# Altium schematic sheet Connectors.SchDoc
size A4; Organization: Deutsches Zentrum für Luft-; Address1: und Raumfahrt e.V. (DLR); Address2: Institut für Materialphysik; Address3: im Weltraum; Address4: Linder Höhe - 51147 Köln; DocumentNumber: 2; SheetNumber: 2; SheetTotal: 4
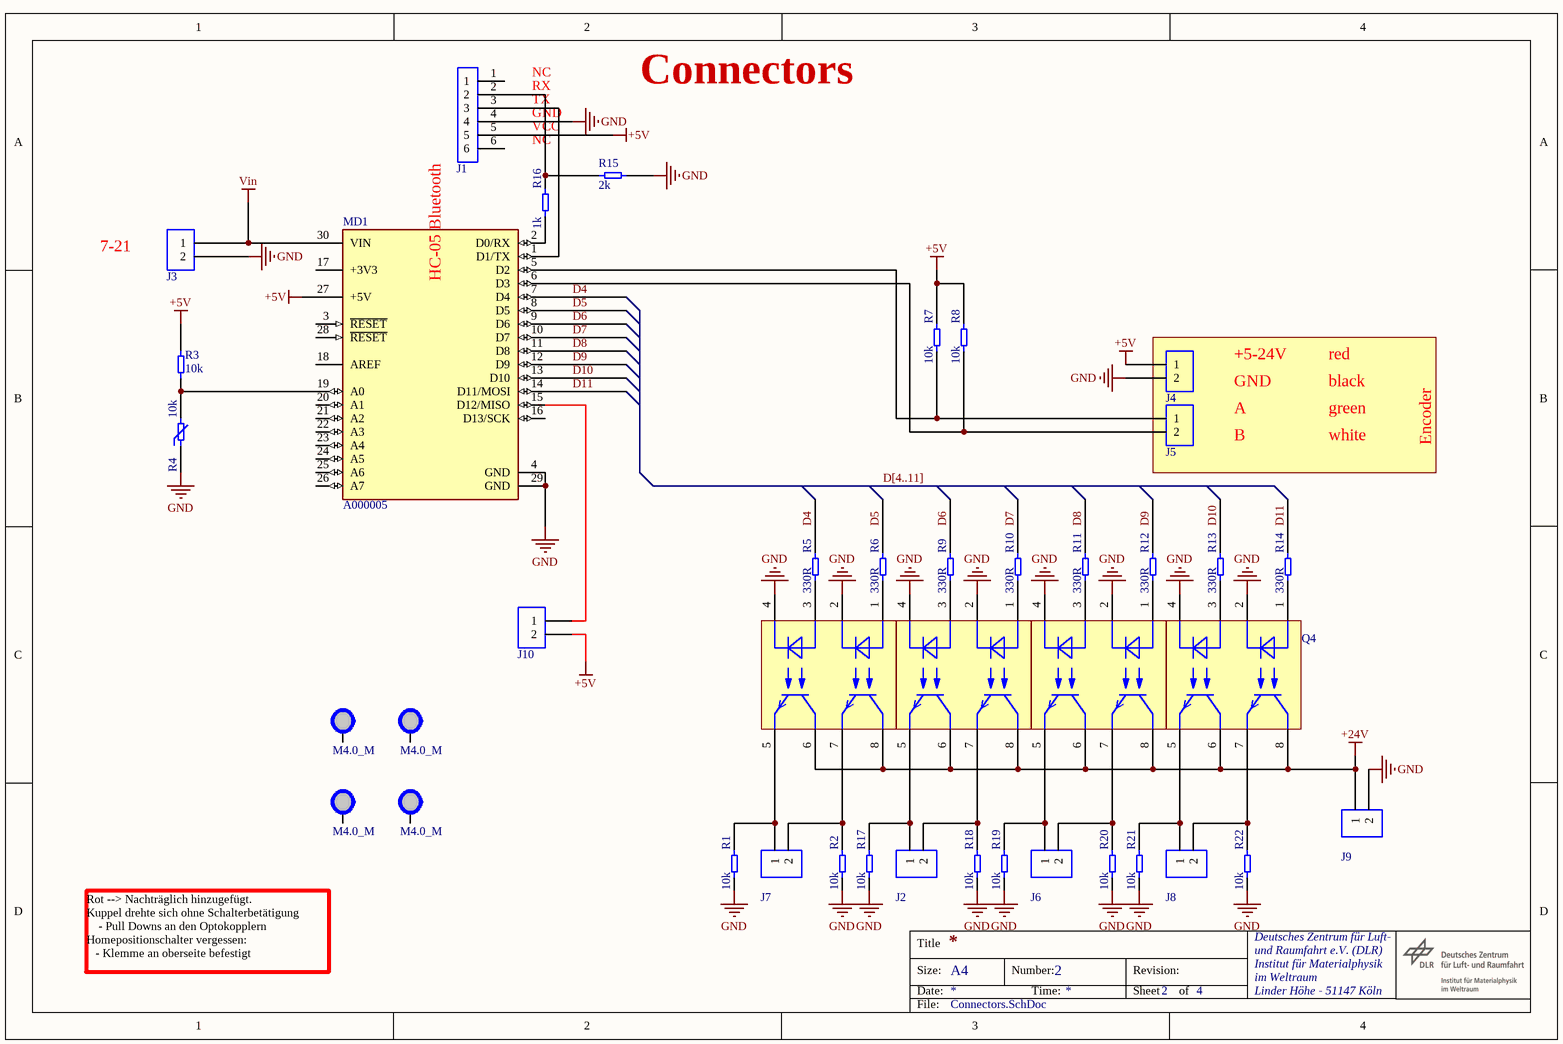
[diagram p0: Connectors.SchDoc]

## Parts
Drill1  M4.0_M  [M4.0_M]  (no BOM)
Drill2  M4.0_M  [M4.0_M]  (no BOM)
Drill3  M4.0_M  [M4.0_M]  (no BOM)
Drill4  M4.0_M  [M4.0_M]  (no BOM)
J1  61300611121  [6P Stiftleiste 2,54]  (value not drawn)
J2  PM_5.08_3_90_3.5_SW_-176052000  [MKDSN 5,08/2 2,5]  (value not drawn)
J3  PM_5.08_3_90_3.5_SW_-176052000  [MKDSN 5,08/2 2,5]  (value not drawn)
J4  PM_5.08_3_90_3.5_SW_-176052000  [MKDSN 5,08/2 2,5]  (value not drawn)
J5  PM_5.08_3_90_3.5_SW_-176052000  [MKDSN 5,08/2 2,5]  (value not drawn)
J6  PM_5.08_3_90_3.5_SW_-176052000  [MKDSN 5,08/2 2,5]  (value not drawn)
J7  PM_5.08_3_90_3.5_SW_-176052000  [MKDSN 5,08/2 2,5]  (value not drawn)
J8  PM_5.08_3_90_3.5_SW_-176052000  [MKDSN 5,08/2 2,5]  (value not drawn)
J9  PM_5.08_3_90_3.5_SW_-176052000  [MKDSN 5,08/2 2,5]  (value not drawn)
J10  PM_5.08_3_90_3.5_SW_-176052000  [MKDSN 5,08/2 2,5]  (value not drawn)
MD1  A000005  [FP-A000005-MFG]
Q1  140827180010  [WL-OCPT_DIP8_Standard]  (value not drawn)
Q2  140827180010  [WL-OCPT_DIP8_Standard]  (value not drawn)
Q3  140827180010  [WL-OCPT_DIP8_Standard]  (value not drawn)
Q4  140827180010  [WL-OCPT_DIP8_Standard]  (value not drawn)
R1  10k  [laser AXIAL-0.5]
R2  10k  [laser AXIAL-0.5]
R3  10k  [laser AXIAL-0.5]
R4  10k  [FP-103AT-2-MFG]
R5  330R  [laser AXIAL-0.5]
R6  330R  [laser AXIAL-0.5]
R7  10k  [laser AXIAL-0.5]
R8  10k  [laser AXIAL-0.5]
R9  330R  [laser AXIAL-0.5]
R10  330R  [laser AXIAL-0.5]
R11  330R  [laser AXIAL-0.5]
R12  330R  [laser AXIAL-0.5]
R13  330R  [laser AXIAL-0.5]
R14  330R  [laser AXIAL-0.5]
R15  2k  [laser AXIAL-0.5]
R16  1k  [laser AXIAL-0.5]
R17  10k  [laser AXIAL-0.5]
R18  10k  [laser AXIAL-0.5]
R19  10k  [laser AXIAL-0.5]
R20  10k  [laser AXIAL-0.5]
R21  10k  [laser AXIAL-0.5]
R22  10k  [laser AXIAL-0.5]

## Nets
+5V: J1.5 J4.1 J10.2 MD1.27(+5V) R3.2 R7.1 R8.1
+24V: J9.1 Q1.6(Collector) Q1.8(Collector) Q2.6(Collector) Q2.8(Collector) Q3.6(Collector) Q3.8(Collector) Q4.6(Collector) Q4.8(Collector)
GND: J1.4 J3.2 J4.2 J9.2 MD1.4(GND) MD1.29(GND) Q1.2(Cathode) Q1.4(Cathode) Q2.2(Cathode) Q2.4(Cathode) Q3.2(Cathode) Q3.4(Cathode) Q4.2(Cathode) Q4.4(Cathode) R1.2 R2.2 R4.1 R15.2 R17.2 R18.2 R19.2 R20.2 R21.2 R22.2
Vin: J3.1 MD1.30(VIN)
D4: MD1.7(D4) R5.1
D5: MD1.8(D5) R6.1
D6: MD1.9(D6) R9.1
D7: MD1.10(D7) R10.1
D8: MD1.11(D8) R11.1
D9: MD1.12(D9) R12.1
D10: MD1.13(D10) R13.1
D11: MD1.14(D11/MOSI) R14.1
NetJ1_2: J1.2 R15.1 R16.2
NetJ1_3: J1.3 MD1.1(D1/TX)
NetJ2_1: J2.1 Q2.5(Emitter) R17.1
NetJ2_2: J2.2 Q2.7(Emitter) R18.1
NetJ5_1: J5.1 MD1.5(D2) R7.2
NetJ5_2: J5.2 MD1.6(D3) R8.2
NetJ6_1: J6.1 Q3.5(Emitter) R19.1
NetJ6_2: J6.2 Q3.7(Emitter) R20.1
NetJ7_1: J7.1 Q1.5(Emitter) R1.1
NetJ7_2: J7.2 Q1.7(Emitter) R2.1
NetJ8_1: J8.1 Q4.5(Emitter) R21.1
NetJ8_2: J8.2 Q4.7(Emitter) R22.1
NetJ10_1: J10.1 MD1.15(D12/MISO)
NetMD1_2: MD1.2(D0/RX) R16.1
NetMD1_19: MD1.19(A0) R3.1 R4.2
NetQ1_1: Q1.1(Anode) R6.2
NetQ1_3: Q1.3(Anode) R5.2
NetQ2_1: Q2.1(Anode) R10.2
NetQ2_3: Q2.3(Anode) R9.2
NetQ3_1: Q3.1(Anode) R12.2
NetQ3_3: Q3.3(Anode) R11.2
NetQ4_1: Q4.1(Anode) R14.2
NetQ4_3: Q4.3(Anode) R13.2

Not connected (* = marked no-connect by the designer): Drill1 1; Drill2 1; Drill3 1; Drill4 1; J1 1 6; MD1 3(~{RESET}) 16(D13/SCK) 17(+3V3) 18(AREF) 20(A1) 21(A2) 22(A3) 23(A4) 24(A5) 25(A6) 26(A7) 28(~{RESET})

## Buses and harness runs
bus D[4..11]

## Notes on the sheet
- (near J1) NC
- (near J1) RX
- (near J1) TX
- (near J1) GND
- Connectors
- (near J1) HC-05 Bluetooth
- NC
- (near J1) VCC
- 7-21
- +5-24V
- GND
- red
- black
- A
- B
- green
- white
- Encoder
- Rot --> Nachträglich hinzugefügt.
  Kuppel drehte sich ohne Schalterbetätigung
  - Pull Downs an den Optokopplern
  Homepositionschalter vergessen:
  - Klemme an oberseite befestigt
- Title
- Size:
- Date:
- A4
- Number:
- Time:
- Revision:
- Sheet
- of
- File:

## Library data of the parts
Drill1-Drill4 = Drill: .CHECKED PCB: RF; .CHECKED SCH: RF
J1 = 6P Stiftleiste 2,54: 6 Pin Stiftleiste Raster 2,54 mm / Wurth Elektronik WR-PHD Series, Series Number 6130, 2.54mm Pitch 6 Way 1 Row Straight PCB Header, Solder Termination / RS Nr.: 61300711121; Geometry.Height: 8.69mm; .CHECKED PCB: RF; RS Part Number: 172-5168; Manufacturer_Name: Wurth Elektronik; Manufacturer_Part_Number: 61300611121; Datasheet Link: https://componentsearchengine.com/Datasheets/3/61300711121.pdf; .CHECKED SCH: RF
J2-J10 = MKDSN 5,08/2 2,5: 间距5.08mm 2pin 10A 300V 可拼接 螺钉式 直插 配线24-14AWG(0.2-2.5)mm²; Manufacturer: Phoenix Contact; Manufacturer Part Number: 1888687; .CHECKED PCB: PS; Current Rating: 16A; Number of Contacts: 2; Voltage Rating: 400V; Number of Levels: 1; Connector Type: Screw; Max Supply Voltage: 250V; Gender: Male; Wire Gauge (Max): 30AWG; Wire Gauge (Min): 12AWG; Wire/Cable Gauge: 24AWG; Pitch: 5.08mm; Approvals: UL,VDE,cULus,CB,EAC; .CHECKED SCH: PS; Supplier 1: RSComponents; Supplier Part Number 1: 8045095; RoHS: Yes; Category: Terminal Blocks; Stock 1: 462; Mount: Through Hole; Number of Pins: 2; Housing Material: Polyamide; Contact Material: Tin; Color: Green; Weight: 0.114993oz; Material: Polyamide; Housing Color: Green; Termination: Screw; Packaging: Bulk; Package Quantity: 50; Orientation: Straight; Number of Rows: 1; Max Current Rating: 16A; Number of Positions Per Level: 2; Current: 10A; Voltage: 300V; Series: COMBICON MKDSN; Number of Positions: 2; Number of Circuits: 2; Number of Poles: 2; Length: 11.6mm; Width: 9.5mm; Height: 10.16mm; Depth: 9.5mm; REACH SVHC: Unknown; RoHS Compliant: Yes; Lead Free: Lead Free; Flammability Rating: UL94 V-0; ComponentLink1URL: https://datasheet.ciiva.com/5765/528137-5765413.pdf?src-supplier=Farnell; ComponentLink1Description: https://datasheet.ciiva.com/5765/528137-5765413.pdf?src-supplier=Farnell; ComponentLink2URL: https://datasheet.ciiva.com/16047/1888687-16047138.pdf?src-supplier=Onlinecomponents.com; ComponentLink2Description: https://datasheet.ciiva.com/16047/1888687-16047138.pdf?src-supplier=Onlinecomponents.com; ComponentLink3URL: https://datasheet.ciiva.com/6751/1888687-6751366.pdf?src-supplier=Digi-Key; ComponentLink3Description: https://datasheet.ciiva.com/6751/1888687-6751366.pdf?src-supplier=Digi-Key; ComponentLink4URL: https://datasheet.ciiva.com/29226/774087-da-01-en-printklemme-1888687-250-st-29226666.pdf?src-supplier=Conrad; ComponentLink4Description: https://datasheet.ciiva.com/29226/774087-da-01-en-printklemme-1888687-250-st-29226666.pdf?src-supplier=Conrad; Supplier 2: Farnell; Supplier Part Number 2: 1792766
MD1 = CMP-189986-000002-1: ARDUINO NANO ATMEGA328 EVAL BRD; Number of Bits: 8; Evaluation Kit: Yes; Operating Supply Voltage: 12V; Interface: I2C; Data Bus Width: 8b; Core Architecture: AVR; Packaging: Bulk; Length: 7inch; Package Quantity: 50; Width: 5inch; REACH SVHC: No SVHC; Weight: 0.358383oz; Series: AVR® ATmega; Height: 0.25inch
Q1-Q4 = CMP-03913-133672522-1: 140827180010 WL-OCPT - Optocoupler Phototransistor; Reverse Voltage: 6V; Forward Voltage: 1.24V; Isolation Voltage: 5kV; Forward Current: 60mA; Ambient Temperature Range High: 125°C; Width: 4.58mm; NexarPartId: 133672522; Ambient Temperature Range Low: -55°C; Max Operating Temperature: 110°C; Length: 6.5mm; RoHS: Compliant; Height: 3.5mm; Min Operating Temperature: -55°C
R1-R3 R5-R22 = R-THT: .CHECKED PCB: PS; .CHECKED SCH: PS
R4 = R_Thermistor 2.54: Thermistor NTC 10KOhm 1% 2-Pin / 103AT-2; Manufacturer: Semitec; Resistance: 10kR; Value: 10kR; Lead Pitch: 2.54mm; Height: 2.4mm; Max Operating Temperature: 110°C; Width: 3.7mm; RoHS Compliant: Yes; Min Operating Temperature: -50°C; Termination: Radial; Packaging: Bulk; Number of Pins: 2; Series: AT; Tolerance: 1%; Length: 17mm; Supplier 1: Mouser; Supplier Part Number 1: 954-103AT-2; Manufacturer Part Number: 103AT-2; RoHS: Yes; Category: Thermistors; Stock 1: 10232; Pricing 1: 1=0,84, 10=0,64, 50=0,64, 100=0,453, 1000=0,344, 10000=0,282 (USD); Case/Package: 72Case; Pins: 2; ComponentLink1URL: https://datasheet.ciiva.com/4505/semitec-atthermistor-371460-4505142.pdf?src-supplier=Mouser; ComponentLink1Description: https://datasheet.ciiva.com/4505/semitec-atthermistor-371460-4505142.pdf?src-supplier=Mouser